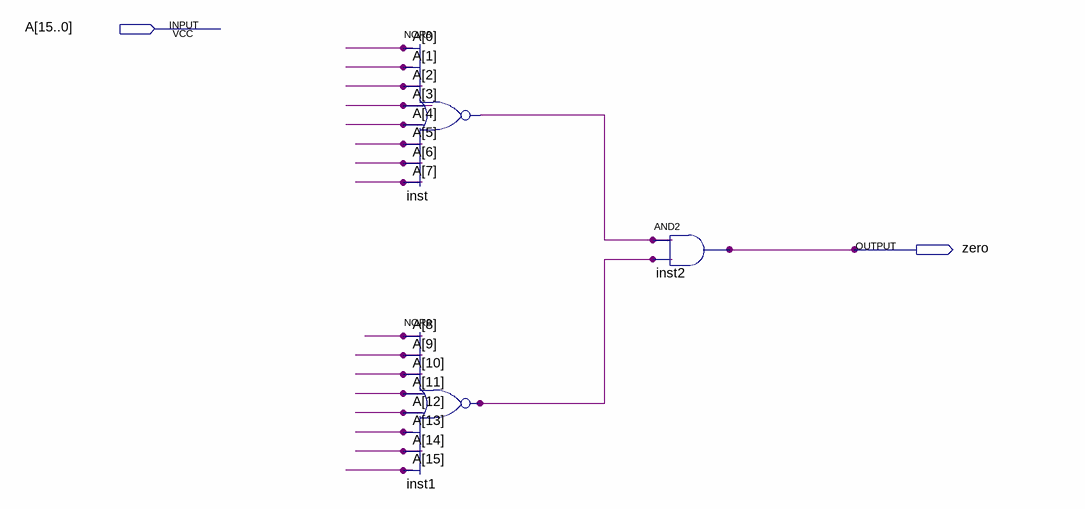
[diagram p0: schematic sheet]
// Quartus schematic zero_detector.bdf as structural Verilog: 3 symbols, 2 pins
module zero_detector (
  input  [15:0] A,
  output zero
);

  wire inst1_out, inst_out;

  nor inst (inst_out, A[0], A[1], A[2], A[3], A[4], A[5], A[6], A[7]);
  nor inst1 (inst1_out, A[8], A[9], A[10], A[11], A[12], A[13], A[14], A[15]);
  and inst2 (zero, inst_out, inst1_out);
endmodule
